# Altium schematic sheet BQ Chip.SchDoc
size A4; SheetNumber: 2; SheetTotal: 6
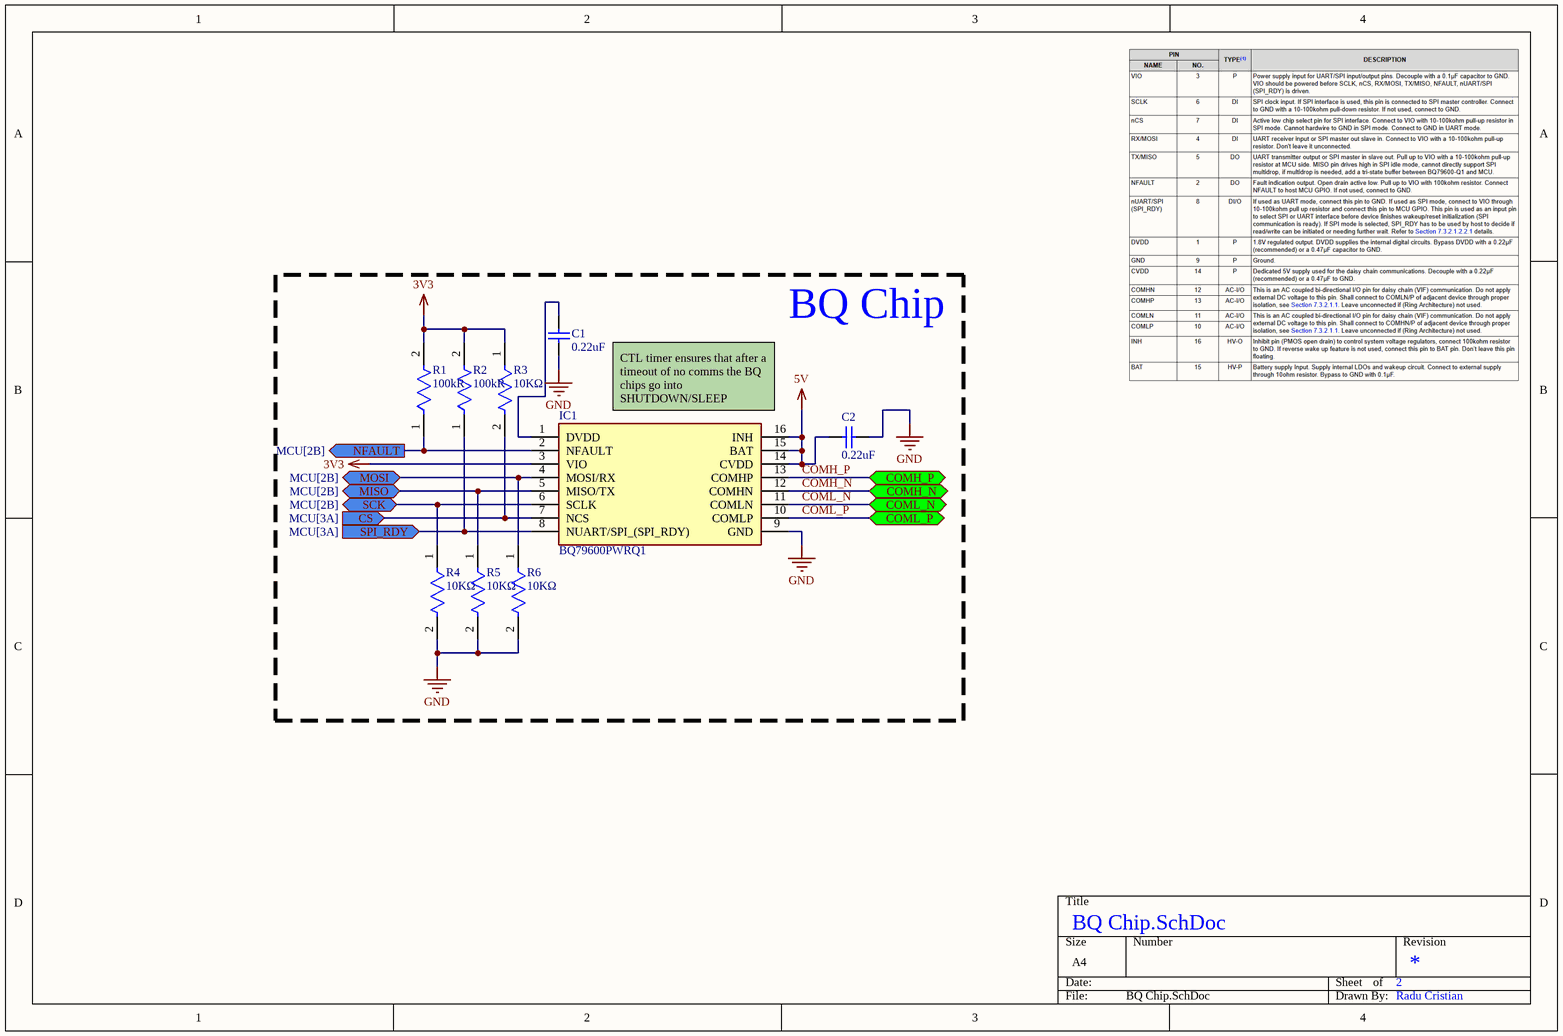
[diagram p0: BQ Chip.SchDoc]

## Parts
C1  Parameter 1: 0.22uF  [CAPC1608X95X40ML15T15]  (hidden comment: VJ0603Y224KXXCW1BC)
C2  Parameter 1: 0.22uF  [CAPC1608X95X40ML15T15]  (hidden comment: VJ0603Y224KXXCW1BC)
IC1  BQ79600PWRQ1  [SOP65P640X120-16N]
R1  Resistance: 100kR  [FP-MCT0603-IPC_C]  (hidden comment: MCT0603MC1003FP500)
R2  Resistance: 100kR  [FP-MCT0603-IPC_C]  (hidden comment: MCT0603MC1003FP500)
R3  Resistance: 10KΩ  [FP-CRGP0603-IPC_C]  (hidden comment: CRGP0603F10K)
R4  Resistance: 10KΩ  [FP-CRGP0603-IPC_C]  (hidden comment: CRGP0603F10K)
R5  Resistance: 10KΩ  [FP-CRGP0603-IPC_C]  (hidden comment: CRGP0603F10K)
R6  Resistance: 10KΩ  [FP-CRGP0603-IPC_C]  (hidden comment: CRGP0603F10K)

## Blocks framed on the sheet
BQ Chip: C1 C2 IC1 R1-R6

## Ports
COMH_N (bidir, see Communication[1B]), COMH_P (bidir, see Communication[1A]), COML_N (bidir, see Communication[1C]), COML_P (bidir, see Communication[1B]), CS (in, see MCU[3A]), MISO (bidir, see MCU[2B]), MOSI (bidir, see MCU[2B]), NFAULT (out, see MCU[2B]), SCK (bidir, see MCU[2B]), SPI_RDY (in, see MCU[3A])

## Nets
3V3: IC1.3(VIO) R1.2 R2.2 R3.1
5V: C2.2 IC1.14(CVDD) IC1.15(BAT) IC1.16(INH)
GND: C1.2 C2.1 IC1.9(GND) R4.2 R5.2 R6.2
COMH_N: IC1.12(COMHN) ; port COMH_N
COMH_P: IC1.13(COMHP) ; port COMH_P
COML_N: IC1.11(COMLN) ; port COML_N
COML_P: IC1.10(COMLP) ; port COML_P
CS: IC1.7(NCS) R3.2 ; port CS
MISO: IC1.5(MISO/TX) R5.1 ; port MISO
MOSI: IC1.4(MOSI/RX) R6.1 ; port MOSI
NFAULT: IC1.2(NFAULT) R1.1 ; port NFAULT
SCK: IC1.6(SCLK) R4.1 ; port SCK
SPI_RDY: IC1.8(NUART/SPI_(SPI_RDY)) R2.1 ; port SPI_RDY
NetC1_1: C1.1 IC1.1(DVDD)

## Notes on the sheet
- (near IC1) CTL timer ensures that after a  timeout of no comms the BQ chips go into SHUTDOWN/SLEEP
- Radu Cristian

## Library data of the parts
C1 C2 = CMP-2006-00068-1: Manufacturer: Vitramon; Part Number: VJ0603Y224KXXCW1BC
IC1 = BQ79600PWRQ1: Integrated Circuit; Manufacturer_Name: Texas Instruments; Datasheet Link: https://www.arrow.com/en/products/bq79600pwrq1/texas-instruments; Height: 1.2mm; Manufacturer_Part_Number: BQ79600PWRQ1; Mouser Part Number: 595-BQ79600PWRQ1; Mouser Price/Stock: https://www.mouser.co.uk/ProductDetail/Texas-Instruments/BQ79600PWRQ1?qs=bAKSY%2FctAC74v4PXQeVHrA%3D%3D; Arrow Part Number: BQ79600PWRQ1; Arrow Price/Stock: https://www.arrow.com/en/products/bq79600pwrq1/texas-instruments?region=nac
R1 R2 = CMP-02407-008119-1: RES SMD 100 OHM 1% 1/8W 0603; Voltage Rating: 75V; Power Rating: 125mW; Length: 1.55mm; Packaging: Tape and Reel; Width: 0.85mm; Case Code (Metric): 1608; Weight: 6.7E-05oz; Tolerance: 1%; Height: 0.45mm; Case Code (Imperial): 0603; Max Operating Temperature: 175°C; Case/Package: 0603; Min Operating Temperature: -55°C; Composition: Thin Film
R3-R6 = CMP-03211-004414-1: CRGP 0603 10K 1%; Manufacturer: TE; Voltage Rating: 50V; Power Rating: 0.25W; Value: 10KΩ; Tolerance: 0.01; Temperature Coefficient: ±100ppm/°C; Octopart: https://octopart.com/crgp0603f10k-te+connectivity-91018721; Temperature Range Low: -55°C; Temperature Range High: +155°C; Device Class L3: Chip SMD Resistors; Package: CRGP0603; Height: 0.55mm; Series: CRGP; RoHS: TRUE; Composition: Thick Film; Digikey Description: CRGP 0603 10K 1%; Ipc Land Pattern Name: RESC16080X45; Mouser Description: Res, 10K, 1%, 0.25W, 0603, Thick Film; ComponentLink2Description: Datasheet; ComponentLink2URL: https://www.te.com/commerce/DocumentDelivery/DDEController?Action=srchrtrv&DocNm=9-1773463-9&DocType=DS&DocLang=English; Manufacturer Part Number: CRGP0603F10K; Temperature: -55°C to +155°C; Device Class L1: Passive Components; Lead Free: Yes; Ambient Temperature Range High: +70°C; Device Class L2: Resistors; Automotive: No; Category: Res